# Altium project WirelessJoystick.PrjPCB
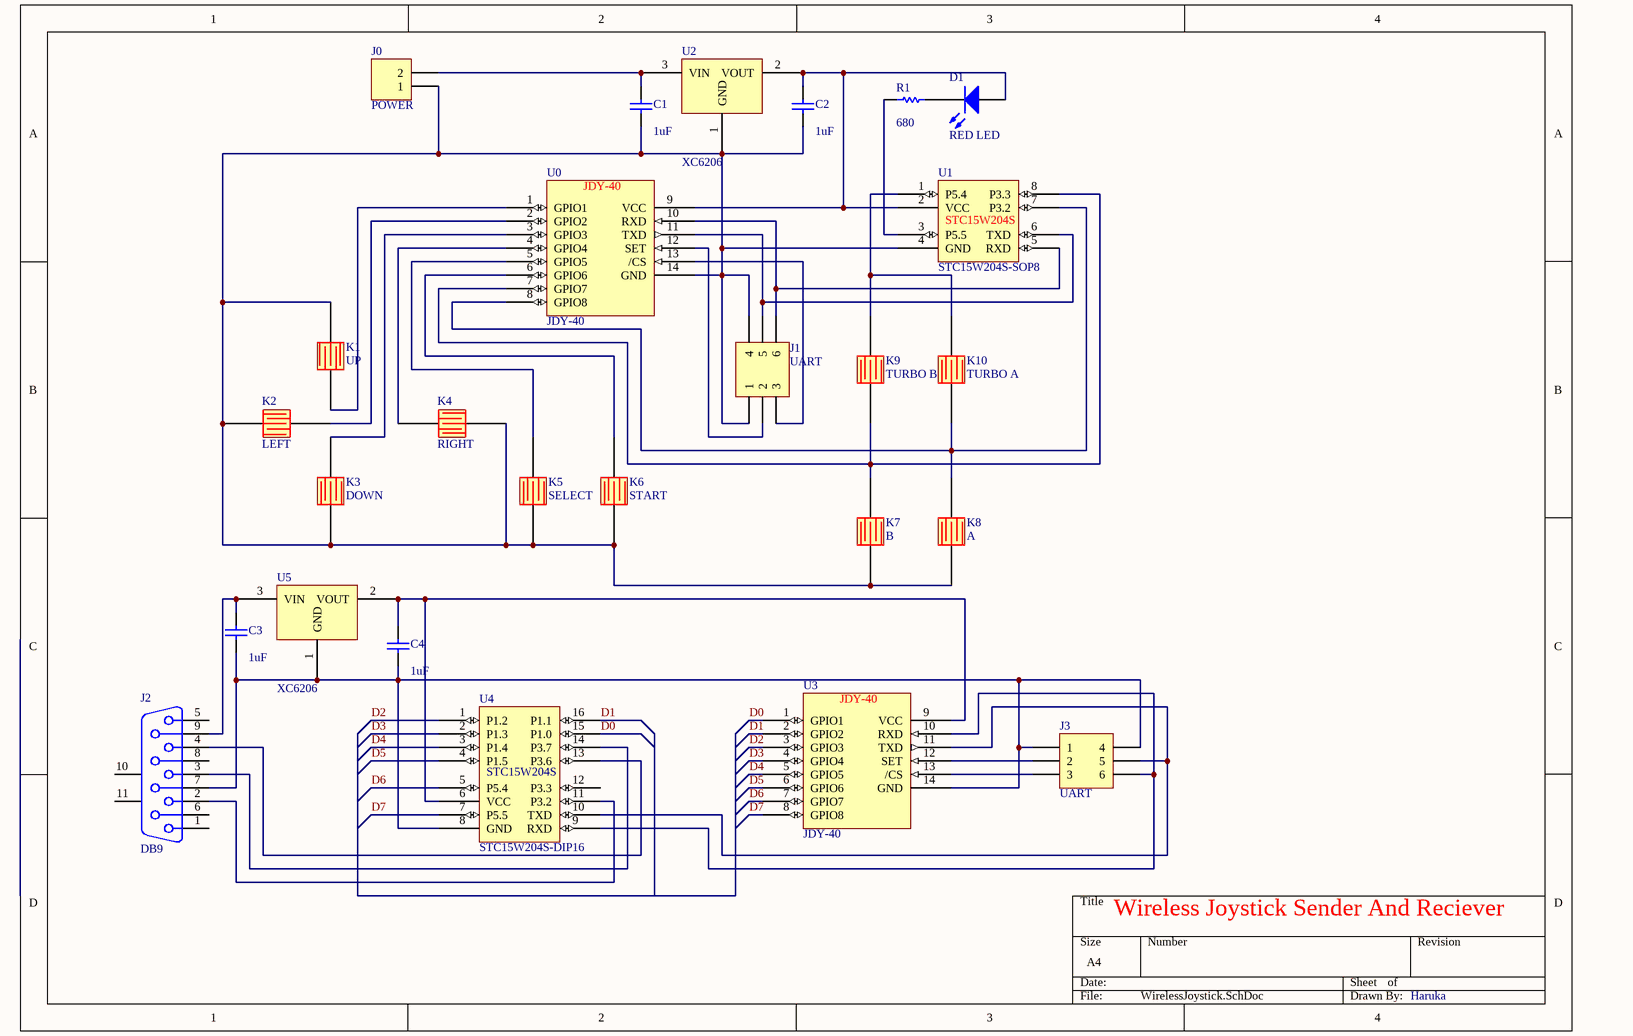
[diagram p0: WirelessJoystick.SchDoc]
1 sheet, 26 parts. Net scope: global (net labels, ports and power ports of the same name join across sheets).
Board files: WirelessJoystick.PcbDoc, WirelessJoystick_Receiver.PcbDoc, Combination.PcbDoc

## Sheet WirelessJoystick.SchDoc
size A4

### Parts
C1  value 1uF  [C1206]  (hidden comment: Cap Semi)
C2  value 1uF  [C1206]  (hidden comment: Cap Semi)
C3  value 1uF  [C1206]  (hidden comment: Cap Semi)
C4  value 1uF  [C1206]  (hidden comment: Cap Semi)
D1  RED LED  [LED-0]
J0  POWER  [HDR1X2]
J1  UART  [HDR2X3_CEN]
J2  DB9  [DSUB1.385-2H9]
J3  UART  [HDR2X3_CEN]
K1  UP  [GoldFinger]
K2  LEFT  [GoldFinger]
K3  DOWN  [GoldFinger]
K4  RIGHT  [GoldFinger]
K5  SELECT  [GoldFinger]
K6  START  [GoldFinger]
K7  B  [GoldFinger]
K8  A  [GoldFinger]
K9  TURBO B  [GoldFinger]
K10  TURBO A  [GoldFinger]
R1  680  [AXIAL-0.3]
U0  JDY-40  [JDY-401]
U1  STC15W204S-SOP8  [SOP8]
U2  XC6206  [SOT23-3N]
U3  JDY-40  [JDY-401]
U4  STC15W204S-DIP16  [DIP16]
U5  XC6206  [SOT23-3N]

### Nets
D0: U3.1(GPIO1) U4.15(P1.0)
D1: U3.2(GPIO2) U4.16(P1.1)
D2: U3.3(GPIO3) U4.1(P1.2)
D3: U3.4(GPIO4) U4.2(P1.3)
D4: U3.5(GPIO5) U4.3(P1.4)
D5: U3.6(GPIO6) U4.4(P1.5)
D6: U3.7(GPIO7) U4.5(P5.4)
D7: U3.8(GPIO8) U4.7(P5.5)
NetC1_1: C1.1 C2.1 J0.1 J1.1 J1.4 K1.1(PIN_1) K2.1(PIN_1) K3.1(PIN_1) K4.1(PIN_1) K5.1(PIN_1) K6.1(PIN_1) K7.1(PIN_1) K8.1(PIN_1) U0.14(GND) U1.4(GND) U2.1(GND)
NetC1_2: C1.2 J0.2 U2.3(VIN)
NetC2_2: C2.2 D1.1(A) U0.9(VCC) U1.2(VCC) U2.2(VOUT)
NetC3_1: C3.1 C4.1 J2.7 J3.1 J3.4 U3.14(GND) U4.8(GND) U5.1(GND)
NetC3_2: C3.2 J2.9 U5.3(VIN)
NetC4_2: C4.2 U3.9(VCC) U4.6(VCC) U5.2(VOUT)
NetD1_2: D1.2(K) R1.2
NetJ1_2: J1.2 U0.12(SET)
NetJ1_3: J1.3 U0.13(/CS)
NetJ1_5: J1.5 U0.11(TXD) U1.6(TXD)
NetJ1_6: J1.6 U0.10(RXD) U1.5(RXD)
NetJ2_2: J2.2 U4.11(P3.2)
NetJ2_3: J2.3 U4.14(P3.7)
NetJ2_4: J2.4 U4.13(P3.6)
NetJ3_2: J3.2 U3.12(SET)
NetJ3_3: J3.3 U3.13(/CS)
NetJ3_5: J3.5 U3.11(TXD) U4.10(TXD)
NetJ3_6: J3.6 U3.10(RXD) U4.9(RXD)
NetK1_2: K1.2(PIN_2) U0.1(GPIO1)
NetK2_2: K2.2(PIN_2) U0.2(GPIO2)
NetK3_2: K3.2(PIN_2) U0.3(GPIO3)
NetK4_2: K4.2(PIN_2) U0.4(GPIO4)
NetK5_2: K5.2(PIN_2) U0.5(GPIO5)
NetK6_2: K6.2(PIN_2) U0.6(GPIO6)
NetK7_2: K7.2(PIN_2) K9.1(PIN_1) U0.7(GPIO7) U1.8(P3.3)
NetK8_2: K8.2(PIN_2) K10.1(PIN_1) U0.8(GPIO8) U1.7(P3.2)
NetK9_2: K9.2(PIN_2) K10.2(PIN_2) U1.1(P5.4)
NetR1_1: R1.1 U1.3(P5.5)

Not connected (* = marked no-connect by the designer): J2 1 5 6 8 10(MH1) 11(MH2); U4 12(P3.3)

### Notes on the sheet
- Wireless Joystick Sender And Reciever
- Haruka
- (in symbol STC15W204S-DIP16) STC15W204S
- (in symbol STC15W204S-SOP8) STC15W204S

### Library data of the parts
C1-C4 = Cap Semi: Capacitor (Semiconductor SIM Model); Published: 8-Jun-2000; LatestRevisionDate: 29-May-2009; LatestRevisionNote: IPC-7351 Footprint Added.; PackageReference: C1206; Publisher: Altium Limited; PackageDescription: Chip Capacitor
D1 = LED0: Typical INFRARED GaAs LED; Published: 8-Jun-2000; LatestRevisionDate: 08-Jul-2005; LatestRevisionNote: Mech Layer 1 removed.; PackageReference: LED-0; Publisher: Altium Limited; PackageDescription: LED; 2 Leads
J0 = Header 2: Header, 2-Pin; LatestRevisionDate: 17-Jul-2002; LatestRevisionNote: Re-released for DXP Platform.; Publisher: Altium Limited
J1 J3 = Header 3X2A: Header, 3-Pin, Dual row; LatestRevisionDate: 17-Jul-2002; LatestRevisionNote: Re-released for DXP Platform.; Publisher: Altium Limited
J2 = D Connector 9: Receptacle Assembly, 9 Position, Right Angle; PackageDocument: O; Positions: 9; Published: 15-Jun-2001; LatestRevisionDate: 17-Jul-2002; LatestRevisionNote: Re-released for DXP Platform.; DatasheetDocument: 1-Sep-1999; PackageReference: 788750; Publisher: Altium Limited; Orientation: Right Angle; Gender: Receptacle
K1-K10 = GoldFinger
R1 = Res1: Resistor; Published: 8-Jun-2000; LatestRevisionDate: 17-Jul-2002; LatestRevisionNote: Re-released for DXP Platform.; PackageReference: AXIAL-0.3; Publisher: Altium Limited; PackageDescription: Axial Device, Thru-Hole; 2 Leads; 0.3 in Pin Spacing; Value: 680